# Altium schematic sheet TP4056.SchDoc: =GlobalProjectName
size 209 x 297 mm; ApprovedBy: Утвердил; CheckedBy: Проверил; Author: Разработал; SheetNumber: 3; SheetTotal: 7; PageSetup: Record=PageOptions|CenterHorizontal=True|CenterVertical=True|PrintScale=1.00|XCorrection=1.00|YCorrection=1.00|PrintKind=1|BorderSize=5000000|LeftOffset=0|BottomOffset=0|Orientation=2|PaperLength=1000|PaperWidth=1000|Scale=100|PaperSource=15|PrintQuality=1200|MediaType=1|DitherType=10|PaperKind=A3|PrintScaleMode=1; Weight: -; ScaleFactor: -; NormInspection: Норм.Контр.
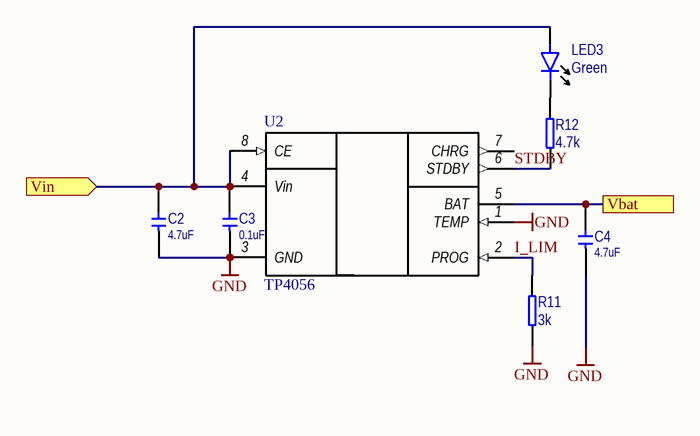
[diagram p0: TP4056.SchDoc]

## Parts
C2  value 4.7uF  [CERCAP 0805]
C3  value 0.1uF  [CERCAP 0402]
C4  value 4.7uF  [CERCAP 0805]
LED3  value Green  [LED 0603]
R11  value 3k  [RES 0402]
R12  value 4.7k  [RES 0402]
U2  TP4056  [SO-8]

## Ports
Vbat, Vin (in)

## Nets
GND: C2.1 C3.1 C4.1 R11.1 U2.1(TEMP) U2.3(GND)
I_LIM: R11.2 U2.2(PROG)
STDBY: R12.1 U2.6(STDBY)
Vbat: C4.2 U2.5(BAT) ; port Vbat
Vin: C2.2 C3.2 LED3.1(Anode) U2.4(Vin) U2.8(CE) ; port Vin
NetLED3_2: LED3.2(Cathode) R12.2

Not connected (* = marked no-connect by the designer): U2 7(CHRG)

## Notes on the sheet
- Подп. и дата
- Инв. № дубл.
- Взам. инв. №
- Инв. № подл.
- Изм.
- Лист
- № докум.
- Подп.
- Дата
- Форма 2а ГОСТ 2.104-2006
- Копировал
- Формат А4

## Library data of the parts
C2-C4 = !Capacitor: Capacitor; IsSMT: NoSMT; Voltage: 10V; Diel: X7R
LED3 = LED: Light Emittering Diode; IsSMT: NoSMT
R11 R12 = !Resistor: Resistor; IsSMT: NoSMT
U2 = TP4056: Charger lin; Order: TP4056